# EAGLE design motiontest (EAGLE 5.04)
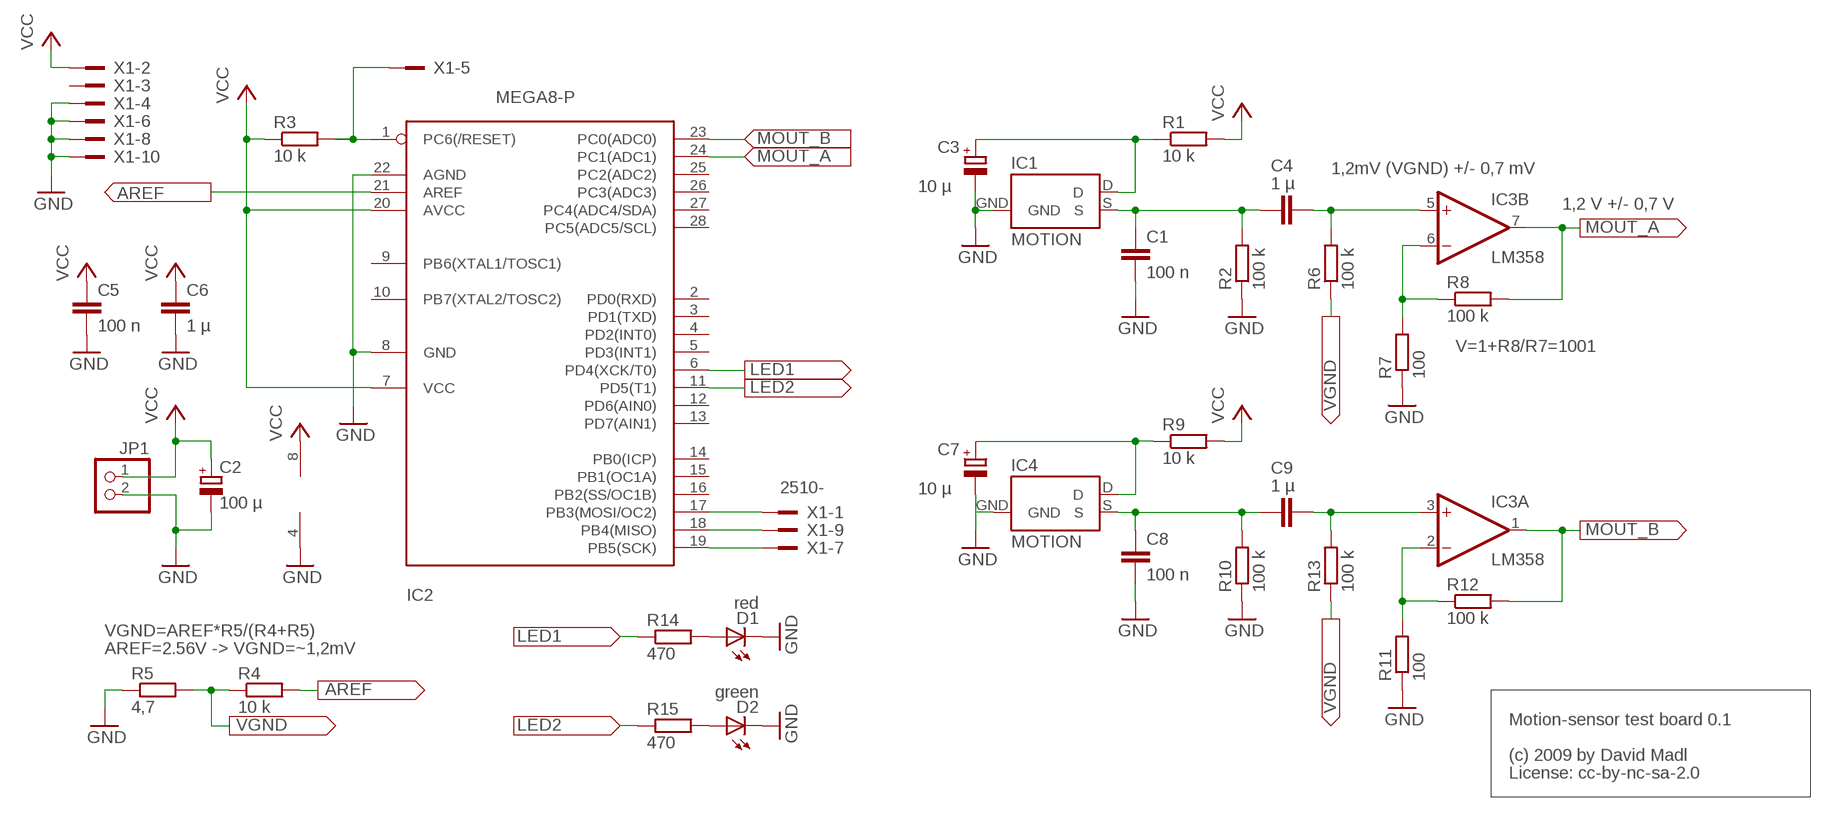
[diagram p0: schematic, sheet 1]

## Parts
C1  100 n  C-EUC1206  [C1206]
C2  100 µ  CPOL-EUB45181A  [B45181A]
C3  10 µ  CPOL-EUB45181A  [B45181A]
C4  1 µ  C-EUC1206  [C1206]
C5  100 n  C-EUC1206  [C1206]
C6  1 µ  C-EUC1206  [C1206]
C7  10 µ  CPOL-EUB45181A  [B45181A]
C8  100 n  C-EUC1206  [C1206]
C9  1 µ  C-EUC1206  [C1206]
D1  red  LED5MM  [LED5MM]
D2  green  LED5MM  [LED5MM]
IC1  MOTION  [MOTION]
IC2  MEGA8-P  [DIL28-3]
IC3  LM358  2AMP_P8+4N  [DIL08]
IC4  MOTION  [MOTION]
JP1  PINHD-1X2  [1X02]
R1  10 k  R-EU_0207/10  [0207/10]
R2  100 k  R-EU_0207/10  [0207/10]
R3  10 k  R-EU_0207/10  [0207/10]
R4  10 k  R-EU_0207/10  [0207/10]
R5  4,7  R-EU_0207/10  [0207/10]
R6  100 k  R-EU_0207/10  [0207/10]
R7  100  R-EU_0207/10  [0207/10]
R8  100 k  R-EU_0207/10  [0207/10]
R9  10 k  R-EU_0207/10  [0207/10]
R10  100 k  R-EU_0207/10  [0207/10]
R11  100  R-EU_0207/10  [0207/10]
R12  100 k  R-EU_0207/10  [0207/10]
R13  100 k  R-EU_0207/10  [0207/10]
R14  470  R-EU_0207/10  [0207/10]
R15  470  R-EU_0207/10  [0207/10]
X1  2510-  [PAK100/2500-10]

## Nets
AREF: IC2.21(AREF) R4.2
GND: C1.2 C2.- C3.- C5.2 C6.2 C7.- C8.2 D1.K(C) D2.K(C) IC1.GND IC2.8(GND) IC2.22(AGND) IC3.4(P:V-) IC4.GND JP1.2 R2.1 R5.1 R7.1 R10.1 R11.1 X1.4 X1.6 X1.8 X1.10
LED1: IC2.6(PD4(XCK/T0)) R14.1
LED2: IC2.11(PD5(T1)) R15.1
MOUT_A: IC2.24(PC1(ADC1)) IC3.7(B:OUT) R8.2
MOUT_B: IC2.23(PC0(ADC0)) IC3.1(A:OUT) R12.2
N$1: C3.+ IC1.D R1.1
N$2: C1.1 C4.1 IC1.S R2.2
N$3: IC2.17(PB3(MOSI/OC2)) X1.1
N$4: C4.2 IC3.5(B:+IN) R6.2
N$5: IC2.18(PB4(MISO)) X1.9
N$6: IC2.19(PB5(SCK)) X1.7
N$7: IC2.1(PC6(/RESET)) R3.2 X1.5
N$8: IC3.6(B:-IN) R7.2 R8.1
N$9: C7.+ IC4.D R9.1
N$10: C8.1 C9.1 IC4.S R10.2
N$11: C9.2 IC3.3(A:+IN) R13.2
N$12: IC3.2(A:-IN) R11.2 R12.1
N$13: D1.A R14.2
N$14: D2.A R15.2
VCC: C2.+ C5.1 C6.1 IC2.7(VCC) IC2.20(AVCC) IC3.8(P:V+) JP1.1 R1.2 R3.1 R9.2 X1.2
VGND: R4.1 R5.2 R6.1 R13.1
Unconnected: IC2.2(PD0(RXD)) IC2.3(PD1(TXD)) IC2.4(PD2(INT0)) IC2.5(PD3(INT1)) IC2.9(PB6(XTAL1/TOSC1)) IC2.10(PB7(XTAL2/TOSC2)) IC2.12(PD6(AIN0)) IC2.13(PD7(AIN1)) IC2.14(PB0(ICP)) IC2.15(PB1(OC1A)) IC2.16(PB2(SS/OC1B)) IC2.25(PC2(ADC2)) IC2.26(PC3(ADC3)) IC2.27(PC4(ADC4/SDA)) IC2.28(PC5(ADC5/SCL)) X1.3

## Notes on the sheet
- 1,2mV (VGND) +/- 0,7 mV
- 1,2 V +/- 0,7 V
- V=1+R8/R7=1001
- VGND=AREF*R5/(R4+R5)
- AREF=2.56V -> VGND=~1,2mV
- Motion-sensor test board 0.1
- (c) 2009 by David Madl
- License: cc-by-nc-sa-2.0

## Library data of the parts
C1 C4-C6 C8 C9 = rcl:C-EU: CAPACITOR, European symbol
C2 C3 C7 = rcl:CPOL-EU: POLARIZED CAPACITOR, European symbol
D1 D2 = led:LED: LED OSRAM: - CHIPLED LG R971, LG N971, LY N971, LG Q971, LY Q971, LO R971, LY R971 LH N974, LH R974 LS Q976, LO Q976, LY Q976 LO Q996 - Hyper CHIPLED LW Q18S LB Q993, LB Q99A, LB R99A - SideLED LS A670, LO A670, LY A670, LG A670, LP A670 LB A673, LV A673, LT A673, LW A673 LH A674 LY A675 LS A676, LA A676, LO A676, LY A676, LW A676 LS A679, LY A679, LG A679 - Hyper Micro SIDELED® LS Y876, LA Y876, LO Y876, LY Y876 LT Y87S - SmartLED LW L88C, LW L88S LB L89C, LB L89S, LG L890 LS L89K, LO L89K, LY L89K LS L896, LA L896, LO L896, LY L896 - TOPLED LS T670, LO T670, LY T670, LG T670, LP T670 LSG T670, LSP T670, LSY T670, LOP T670, LYG T670 LG T671, LOG T671, LSG T671 LB T673, LV T673, LT T673, LW T673 LH T674 LS T676, LA T676, LO T676, LY T676, LB T676, LH T676, LSB T676, LW T676 LB T67C, LV T67C, LT T67C, LS T67K, LO T67K, LY T67K, LW E67C LS E67B, LA E67B, LO E67B, LY E67B, LB E67C, LV E67C, LT E67C LW T67C LS T679, LY T679, LG T679 LS T770, LO T770, LY T770, LG T770, LP T770 LB T773, LV T773, LT T773, LW T773 LH T774 LS E675, LA E675, LY E675, LS T675 LS T776, LA T776, LO T776, LY T776, LB T776 LHGB T686 LT T68C, LB T68C - Hyper Mini TOPLED® LB M676 - Mini TOPLED Santana® LG M470 LS M47K, LO M47K, LY M47K Source: http://www.osram.convergy.de LUXEON: - LUMILED® LXK2-PW12-R00, LXK2-PW12-S00, LXK2-PW14-U00, LXK2-PW14-V00 LXK2-PM12-R00, LXK2-PM12-S00, LXK2-PM14-U00 LXK2-PE12-Q00, LXK2-PE12-R00, LXK2-PE12-S00, LXK2-PE14-T00, LXK2-PE14-U00 LXK2-PB12-K00, LXK2-PB12-L00, LXK2-PB12-M00, LXK2-PB14-N00, LXK2-PB14-P00, LXK2-PB14-Q00 LXK2-PR12-L00, LXK2-PR12-M00, LXK2-PR14-Q00, LXK2-PR14-R00 LXK2-PD12-Q00, LXK2-PD12-R00, LXK2-PD12-S00 LXK2-PH12-R00, LXK2-PH12-S00 LXK2-PL12-P00, LXK2-PL12-Q00, LXK2-PL12-R00 Source: www.luxeon.com KINGBRIGHT: KA-3528ASYC Source: www.kingbright.com
IC1 IC4 = motion:MOTION
IC2 = atmel:MEGA8-P: MICROCONTROLLER 8 Kbytes FLASH, 1 kbytes SRAM, 512 bytes EEPROM, USART, 4-channel 10 bit ADC, 2-channel 8 bit ADC Pin compatible with Atmega48, ATMega88, ATMega168 Source: avr.lbr
IC3 = linear:2AMP_P8+4: OP AMP
JP1 = pinhead:PINHD-1X2: PIN HEADER
R1-R15 = rcl:R-EU_: RESISTOR, European symbol
X1 = con-3m:2510-: 3M (TM) Pak 100 4-Wall Header Source: 3M

## Board
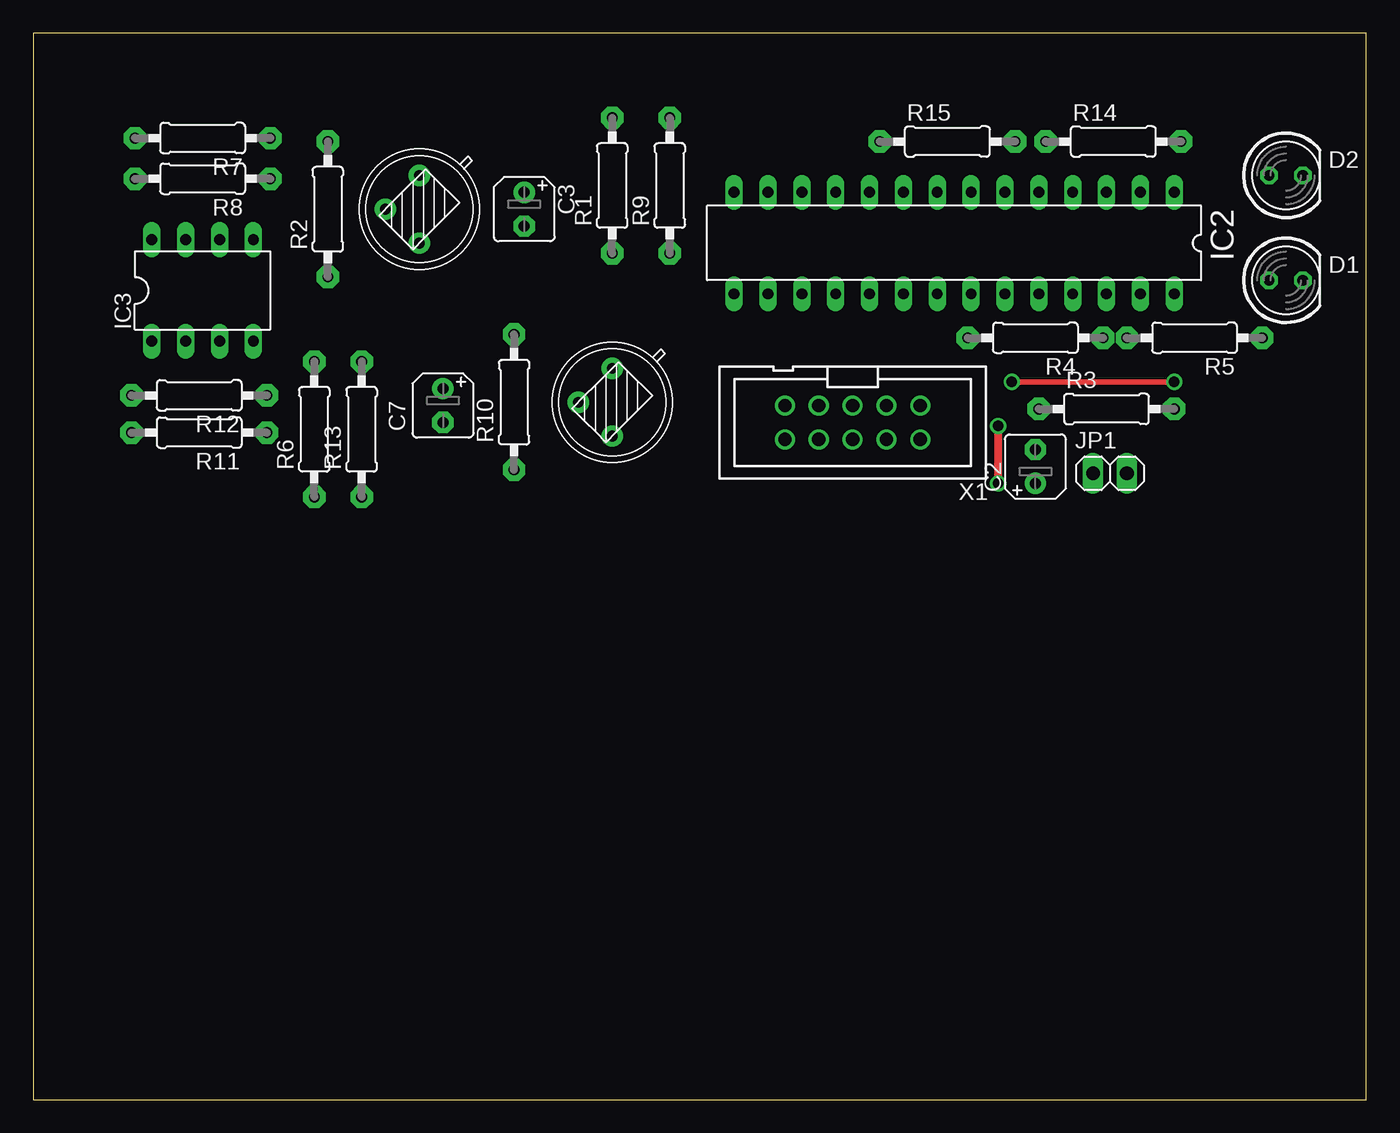
[diagram p1: board, top side]
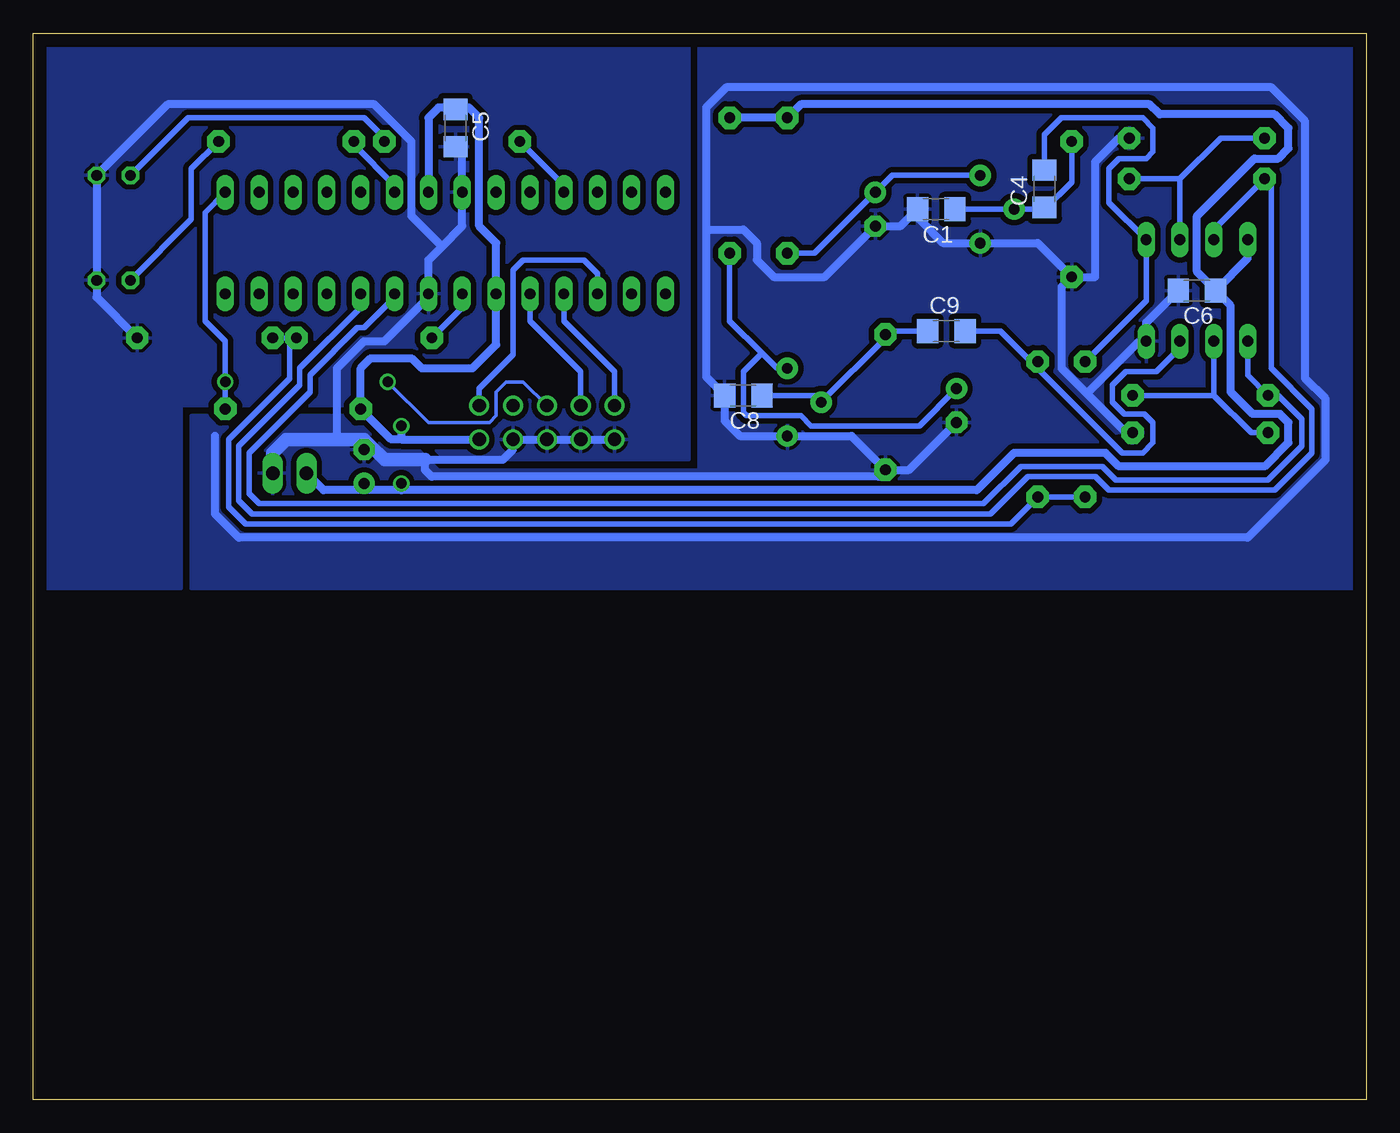
[diagram p2: board, bottom side, seen from below]

Size 100 x 80 mm. Coordinates in mm from the lower left corner, seen from the top.
Outline: 0,0 100,0 100,80 0,80 0,0
Copper layers (1*16): Top 0.035mm / dielectric 1.5mm / Bottom 0.035mm
Design rules "default": minimum track width 10mil, minimum drill 24mil, track to track 8mil, track to pad 8mil, pad to pad 8mil, via to via 8mil, smd to smd 8mil, copper to edge 40mil, drill to drill 8mil, minimum pad ring 10mil, minimum via ring 8mil, stop-mask expansion 4mil, vias tented up to drill 0mil, thermal gap 10mil

### Footprints (pad centres in the part's own frame; a part is rotated, then mirrored left to right if it is on the bottom)
C1206 = smd 1.6 x 1.8: 1 -1.4,0; 2 1.4,0
B45181A = drill 0.813 pad 1.6 round: + -1.27,0 | drill 0.813 pad 1.6 octagon: - 1.27,0
LED5MM = drill 0.813 octagon: A -1.27,0; K 1.27,0
MOTION = drill 0.8 pad 1.6 round: D 0,5.08; GND 0,0; S -2.54,2.54
DIL28-3 = drill 0.813 long: 1 -16.51,-3.81; 2 -13.97,-3.81; 3 -11.43,-3.81; 4 -8.89,-3.81; 5 -6.35,-3.81; 6 -3.81,-3.81; 7 -1.27,-3.81; 8 1.27,-3.81; 9 3.81,-3.81; 10 6.35,-3.81; 11 8.89,-3.81; 12 11.43,-3.81; 13 13.97,-3.81; 14 16.51,-3.81; 15 16.51,3.81; 16 13.97,3.81; 17 11.43,3.81; 18 8.89,3.81; 19 6.35,3.81; 20 3.81,3.81; 21 1.27,3.81; 22 -1.27,3.81; 23 -3.81,3.81; 24 -6.35,3.81; 25 -8.89,3.81; 26 -11.43,3.81; 27 -13.97,3.81; 28 -16.51,3.81
DIL08 = drill 0.813 long: 1 -3.81,-3.81; 2 -1.27,-3.81; 3 1.27,-3.81; 4 3.81,-3.81; 5 3.81,3.81; 6 1.27,3.81; 7 -1.27,3.81; 8 -3.81,3.81
1X02 = drill 1.016 long: 1 -1.27,0; 2 1.27,0
0207/10 = drill 0.813 pad 1.676 octagon: 1 -5.08,0; 2 5.08,0
PAK100/2500-10 = drill 1 pad 1.422 round: 1 -5.08,-1.27; 2 -5.08,1.27; 3 -2.54,-1.27; 4 -2.54,1.27; 5 0,-1.27; 6 0,1.27; 7 2.54,-1.27; 8 2.54,1.27; 9 5.08,-1.27; 10 5.08,1.27

### Placement (x,y rotation side)
C1  32.26,66.8 180 bottom
C2  75.18,47.5 90 top
C3  36.83,66.8 270 top
C4  24.13,68.33 90 bottom
C5  68.33,72.9 270 bottom
C6  12.7,60.71 180 bottom
C7  30.73,52.07 270 top
C8  46.74,52.83 180 bottom
C9  31.5,57.66 0 bottom
D1  93.98,61.47 0 top
D2  93.98,69.34 0 top
IC1  28.96,64.26 0 top
IC2  69.09,64.26 180 top
IC3  12.7,60.71 0 top
IC4  43.43,49.78 0 top
JP1  80.77,46.99 0 top
R1  43.43,68.58 90 top
R2  22.1,66.8 90 top
R3  80.52,51.82 0 top
R4  75.18,57.15 180 top
R5  87.12,57.15 180 top
R6  21.08,50.29 90 top
R7  12.7,72.14 180 top
R8  12.7,69.09 180 top
R9  47.75,68.58 90 top
R10  36.07,52.32 90 top
R11  12.45,50.04 180 top
R12  12.45,52.83 180 top
R13  24.64,50.29 90 top
R14  81.03,71.88 0 top
R15  68.58,71.88 0 top
X1  61.47,50.8 180 top

### Tracks (layer width: path | path; a pad name or v marks a point on that pad's centre or on a via)
AREF
  Bottom 0.406: R4.2 67.82,59.44 IC2.21
GND
  Bottom 0.406: C1.2 33.66,66.17 | 74.8,49.15 C2.-
  Bottom 0.61: 69.34,64.01 70.36,62.99 IC2.22 70.36,60.2 73.66,56.9 75.18,56.9 77.22,54.86 77.22,49.53 75.18,49.53 | 69.34,64.01 67.82,65.53 IC2.8 67.82,70.99 C5.2 | X1.10 X1.8 X1.6 X1.4 64.01,48.77 64.77,48.01 70.61,48.01 70.61,47.24 70.1,46.74 36.58,46.74 R10.1 | R5.1 95.25,60.2 D1.K D2.K 89.92,74.68 74.42,74.68 71.63,71.88 71.63,66.29 69.34,64.01 | R2.1 24.64,64.26 IC1.GND 31.75,64.26 33.53,66.04 C1.2 34.93,65.53 C3.- 40.64,61.72 44.45,61.72 45.72,62.99 45.72,64.26 46.74,65.28 49.53,65.28 | R10.1 38.61,49.78 IC4.GND 46.99,49.78 48.14,50.93 C8.2 49.53,54.23 49.53,65.28 | R10.1 34.29,47.24 C7.- | C6.2 16.51,58.3 IC3.4 17.02,56.9 20.95,52.96 | R7.1 18.54,72.14 20.32,70.36 20.32,61.72 R2.1 | R2.1 22.86,60.96 22.86,54.86 20.95,52.96 | R11.1 18.03,50.04 20.95,52.96 | 49.53,65.28 49.53,74.42 48.01,75.95 7.11,75.95 4.57,73.41 4.57,54.1 3.05,52.58 3.05,48.01 8.89,42.16 84.58,42.16 86.36,43.94 86.36,49.78
  Bottom 1.016: 70.61,48.01 73.66,48.01 74.8,49.15 75.18,49.53 81.03,49.53 82.04,48.51 JP1.2
  pour Bottom (isolate 0.406): 50.04,73.91 50.04,76.45 50.04,77.47 50.04,79.76 0.25,79.76 0.25,40.13 0.25,38.35 88.14,38.35 88.14,51.31 75.95,51.31 73.66,49.02 71.37,49.02 69.6,47.24 50.04,47.24
  pour Bottom (isolate 0.406): 50.8,79.76 50.8,48.01 69.09,48.01 70.87,49.78 73.41,49.78 75.69,52.07 88.9,52.07 88.9,38.35 99.57,38.35 99.57,79.76
LED1
  Bottom 0.406: IC2.6 72.9,68.58 75.95,71.63 R14.1
LED2
  Bottom 0.406: IC2.11 60.2,68.58 R15.1
MOUT_A
  Bottom 0.406: IC3.7 11.43,65.28 R8.2 7.11,68.58 7.11,54.86 4.06,51.82 4.06,48.51 6.86,45.72 19.3,45.72 20.32,46.74 25.4,46.74 28.19,43.94 83.57,43.94 84.58,44.96 84.58,49.02 80.01,53.59 80.01,54.86 75.44,59.44 IC2.24
MOUT_B
  Bottom 0.406: IC3.1 8.89,54.36 R12.2 6.6,52.83 4.83,51.05 4.83,49.02 7.37,46.48 18.8,46.48 19.81,47.5 25.91,47.5 28.7,44.7 83.06,44.7 83.82,45.47 83.82,48.51 79.25,53.09 79.25,54.36 75.69,57.91 75.18,57.91 72.9,60.2 IC2.23
N$1
  Bottom 0.406: IC1.D 35.56,69.34 C3.+ 41.4,63.5 R1.1
N$2
  Bottom 0.406: C1.1 IC1.S 24.13,66.8 | R2.2 22.1,68.83 24.13,66.8 | C4.1 24.13,66.8
N$3
  Bottom 0.406: X1.1 66.55,53.34 64.01,55.88 64.01,62.23 63.25,62.99 58.67,62.99 57.66,61.98 IC2.17
N$4
  Bottom 0.406: C4.2 24.13,72.39 22.86,73.66 16.76,73.66 16,72.9 16,71.12 16.51,70.61 18.54,70.61 19.3,69.85 19.3,67.31 IC3.5 16.51,59.94 R6.2
N$5
  Bottom 0.406: X1.9 56.39,54.61 60.2,58.42 IC2.18
N$6
  Bottom 0.406: X1.7 58.93,54.61 62.74,58.42 IC2.19
N$7  (via drill 0.8)
  Top 0.406: v73.41,53.85 v85.6,53.85
  Bottom 0.254: v73.41,53.85 70.36,50.8 65.79,50.8 65.28,51.31 65.28,53.09 64.52,53.85 63.25,53.85 X1.5
  Bottom 0.406: R3.2 v85.6,53.85 85.6,56.9 87.12,58.42 87.12,66.55 IC2.1
N$8
  Bottom 0.406: IC3.6 13.97,69.09 | R7.2 10.92,72.14 13.97,69.09 | 13.97,69.09 R8.1
N$9
  Bottom 0.406: 45.34,56.01 44.2,54.86 IC4.D | 45.34,56.01 47.75,58.42 R9.1 | C7.+ 33.53,50.55 41.66,50.55 42.42,51.31 46.48,51.31 46.74,51.56 46.74,54.61 45.34,56.01
N$10
  Bottom 0.406: C8.1 41.4,52.83 IC4.S 36.07,57.15 R10.2 35.81,57.66 C9.1
N$11
  Bottom 0.406: IC3.3 13.97,56.39 15.75,54.61 18.03,54.61 19.05,53.59 19.05,52.32 18.16,51.44 16.64,51.44 16,50.8 16,49.28 16.76,48.51 18.29,48.51 24.89,55.12 | C9.2 27.43,57.66 24.89,55.12 | 24.89,55.12 R13.2
N$12
  Bottom 0.406: 11.43,52.83 IC3.2 | 11.43,52.83 R12.1 | R11.2 8.64,50.04 11.43,52.83
N$13
  Bottom 0.406: R14.2 88.14,69.85 88.14,66.04 D1.A
N$14
  Bottom 0.406: R15.2 73.66,72.14 75.18,73.66 88.39,73.66 D2.A
VCC  (via drill 0.8)
  Top 0.61: v72.39,46.23 v72.39,50.55
  Bottom 0.406: 75.18,45.72 C2.+
  Bottom 0.61: 68.33,74.42 67.31,74.42 66.55,73.66 66.55,65.53 65.28,64.26 IC2.20 65.28,56.64 67.06,54.86 70.87,54.86 71.63,55.63 74.68,55.63 75.44,54.86 R3.1 73.15,49.53 72.39,49.53 | 68.33,74.42 69.6,74.42 70.36,73.66 IC2.7 | 72.39,49.53 X1.2 | 68.33,74.42 C5.1 | C6.1 8.89,63.12 IC3.8 | R9.2 R1.2 42.42,74.68 16.26,74.68 15.49,73.91 6.86,73.91 5.84,72.9 5.84,71.37 6.6,70.61 8.38,70.61 12.7,66.29 12.7,62.11 C6.1 | C6.1 10.16,59.57 10.16,53.09 8.51,51.44 6.48,51.44 5.84,50.8 5.84,49.28 7.62,47.5 18.54,47.5 19.56,48.51 26.42,48.51 29.21,45.72 72.39,45.72 | 72.39,45.72 75.18,45.72 78.23,45.72 JP1.1 | v72.39,50.55 72.39,49.53 | 72.39,45.72 v72.39,46.23
VGND
  Bottom 0.406: 80.77,57.15 R5.2 | 80.77,57.15 R4.1 | R6.1 R13.1 26.67,43.18 84.07,43.18 85.34,44.45 85.34,49.53 80.77,54.1 80.77,57.15